# EAGLE design Own_Power.Measuring.Bridge.dev_v1.0_Final_AR (EAGLE 9.6.2)
COMPANY: ADAFRUIT INDUSTRIES; DRAWN: KTOWN; REV: A; YEAR: 2019
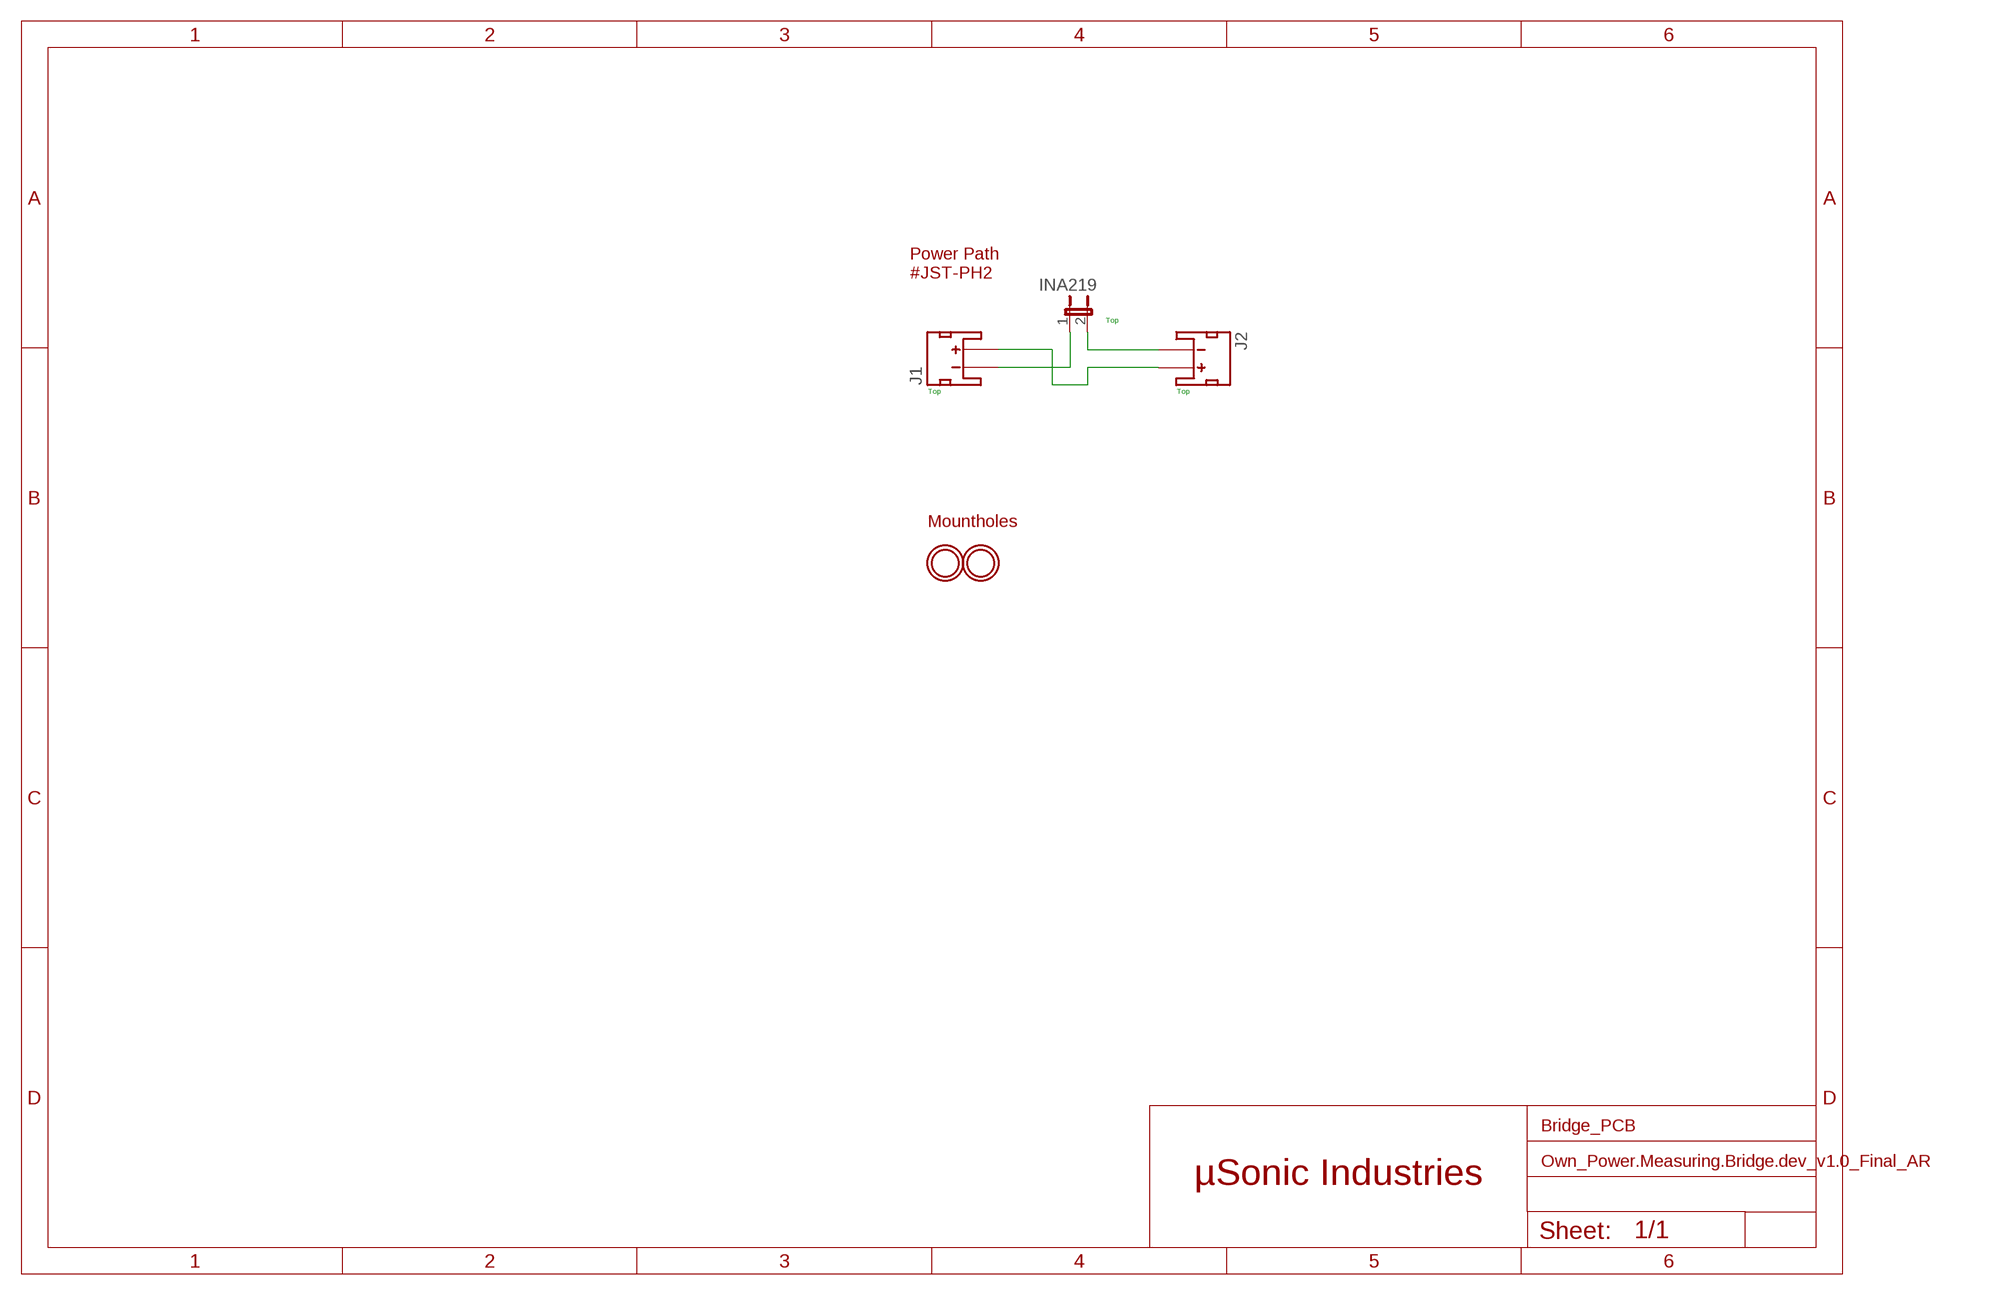
[diagram p0: schematic, sheet 1]

## Parts
INA219  JP1E  [JP1]
J1  Input  JST_2MM_MALE  [JST-2-SMD]
J2  Output  JST_2MM_MALE  [JST-2-SMD]
U$18  MOUNTINGHOLE2.5  [MOUNTINGHOLE_2.5_PLATED]
U$19  MOUNTINGHOLE2.5  [MOUNTINGHOLE_2.5_PLATED]

## Nets
3V3: J1.2(+) J2.2(+)
GND1: INA219.1 J1.1(-)
GND2: INA219.2 J2.1(-)
Unconnected: J1.NC1(PAD1) J1.NC2(PAD2) J2.NC1(PAD1) J2.NC2(PAD2)

## Notes on the sheet
- Power Path
  #JST-PH2
- Top
- Top | Top
- Mountholes
- Bridge_PCB
- µSonic Industries

## Library data of the parts
INA219 = jumper:JP1E: JUMPER
J1 J2 = SparkFun-Connectors2:JST_2MM_MALE: JST 2MM MALE RA CONNECTOR Two pin, compact surface mount connector. Commonly used as a battery input connection point. We really like the solid locking feeling and high current rating on these small connectors. We use these all the time as battery connectors. Mates to single-cell LiPo batteries. Here is the connector we sell at SparkFun: JST Right Angle Connector - White <https://www.sparkfun.com/products/8612> (PRT-08612) Datasheet <http://www.sparkfun.com/datasheets/Prototyping/Connectors/JST-Horizontal.pdf> It was used on these SparkFun products: SparkFun MOSFET Power Controller <https://www.sparkfun.com/products/11214> (PRT-11214) SparkFun Battery Babysitter - LiPo Battery Manager <https://www.sparkfun.com/products/13777> (PRT-13777) And many, many others that required a lipo battery connection.; PROD_ID: CONN-11443; SF_ID: PRT-08612
U$18 U$19 = microbuilder:MOUNTINGHOLE: Mounting Hole For #2 screws (0.086"/2.18mm width, 0.094"/2.4mm hole) use 2.5mm; BOM: EXCLUDE

## Net classes
0 default: width 0.2 mm

## Board
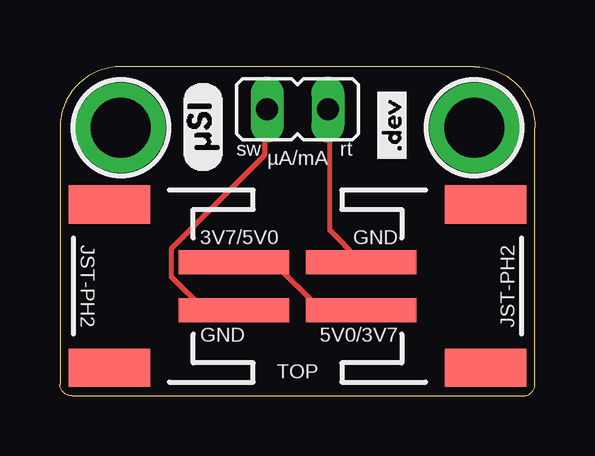
[diagram p1: board, top side]
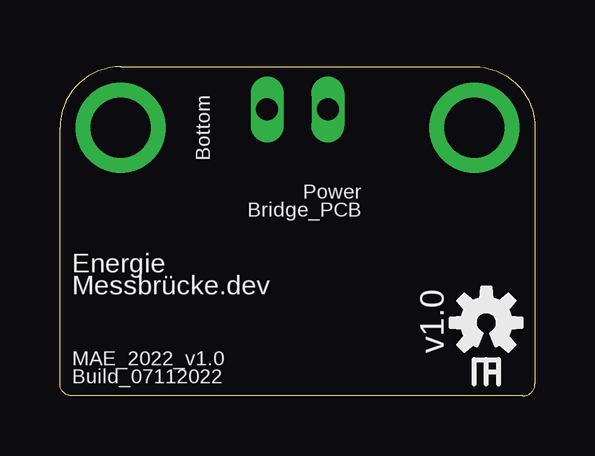
[diagram p2: board, bottom side, seen from below]

Size 19.81 x 13.72 mm. Coordinates in mm from the lower left corner, seen from the top.
Outline: 0,11.18 0,0.51 arc90 0.51,0 19.3,0 arc90 19.81,0.51 19.81,11.18 arc90 17.27,13.72 2.54,13.72 arc90 0,11.18
Copper layers (1*16): Top 0.035mm / dielectric 1.5mm / Bottom 0.035mm
Design rules "aisler_2_layer_complex": minimum track width 0.125mm, minimum drill 0.2mm, track to track 0.125mm, track to pad 0.125mm, pad to pad 0.125mm, via to via 0.125mm, smd to smd 0.125mm, copper to edge 0.3mm, drill to drill 0.25mm, minimum pad ring 0.2mm, minimum via ring 0.2mm, stop-mask expansion 0mil, vias tented up to drill 0mil, thermal gap 10mil

### Footprints (pad centres in the part's own frame; a part is rotated, then mirrored left to right if it is on the bottom)
JP1 = drill 0.914 long: 1 0,-1.27; 2 0,1.27
JST-2-SMD = smd 1 x 4.6: 1 -1,-3.7; 2 1,-3.7 | smd 1.6 x 3.4: NC1 -3.4,1.5; NC2 3.4,1.5
MOUNTINGHOLE_2.5_PLATED = drill 2.5 pad 3.2: P$1 0,0

### Placement (x,y rotation side)
INA219  9.91,11.94 270 top
J1  3.56,4.57 90 top
J2  16.26,4.57 270 top
U$2  [#DEV0]  13.84,9.53 90 top
U$4  [OSHW-LOGO-S]  2.03,3.05 0 bottom
U$5  [#SI0]  5.97,9.27 90 top
U$18  17.27,11.18 0 top
U$19  2.54,11.18 0 top

### Tracks (layer width: path | path; a pad name or v marks a point on that pad's centre or on a via)
3V3
  Top 0.2: J2.2 12.45,3.6 10.86,3.6 8.91,5.55 7.35,5.55 J1.2
GND1
  Top 0.175: 7.2,3.6 J1.1
  Top 0.2: 7.2,3.6 6,3.6 4.65,4.95 4.65,6.15 8.55,10.05 8.55,11.85 INA219.1
GND2
  Top 0.2: INA219.2 11.25,11.85 11.25,6.9 12.45,5.7 J2.1

### Text on the board
tPlace: sw | µA/mA | rt | 3V7/5V0 | GND | JST-PH2 | JST-PH2 | GND | 5V0/3V7 | TOP
bPlace: Bottom | Power / Bridge_PCB | Energie / Messbrücke.dev | v1.0 | MAE_2022_v1.0 / Build_07112022